# EAGLE design rfm69_rfm12b_header (EAGLE 6.5.0)
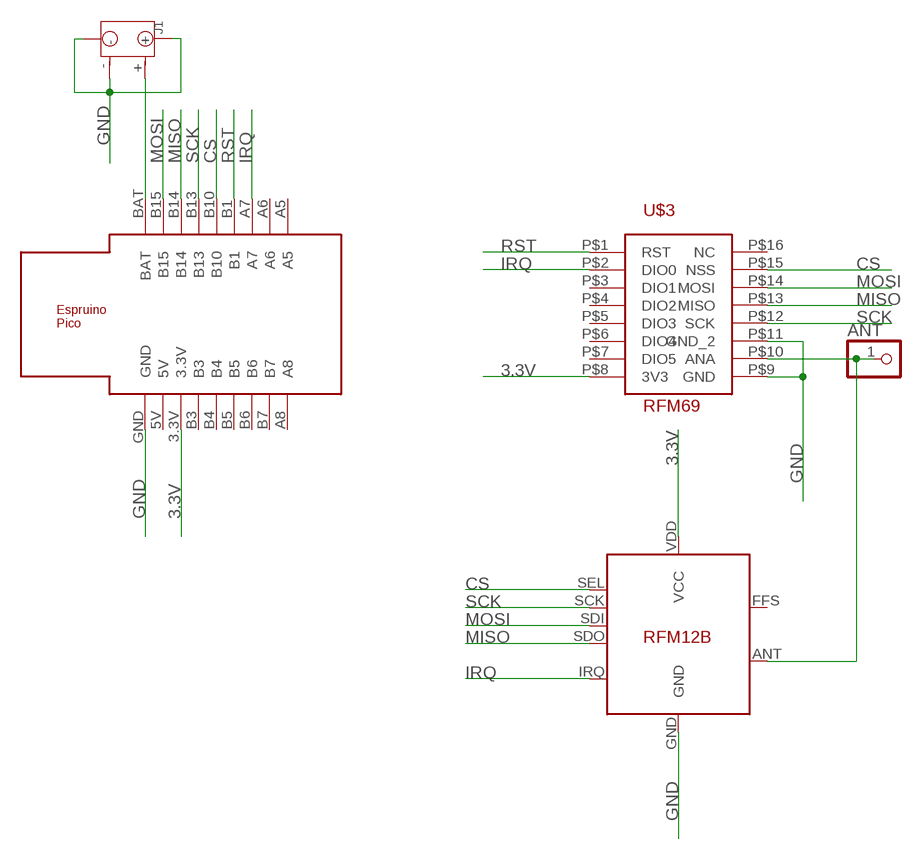
[diagram p0: schematic, sheet 1]

## Parts
ANT  PINHD-1X1  [1X01]
J1  JST-2P-SMD-PW-3410050P1  [2P-SMD-2.0-90D]
U$1  ESPRUINO_PICO_0.1  [ESPRUINO_PICO_0.1]
U$2  RFM12B  [RFM12B]
U$3  RFM69  [RFM69]

## Nets
3.3V: U$1.3.3V U$2.VDD(VCC) U$3.P$8(3V3)
CS: U$1.B10 U$2.SEL U$3.P$15(NSS)
GND: J1.3 J1.4 J1.- U$1.GND U$2.GND U$3.P$9(GND) U$3.P$11(GND_2)
IRQ: U$1.A7 U$2.IRQ U$3.P$2(DIO0)
MISO: U$1.B14 U$2.SDO U$3.P$13(MISO)
MOSI: U$1.B15 U$2.SDI U$3.P$14(MOSI)
N$1: ANT.1 U$2.ANT U$3.P$10(ANA)
N$2: J1.+ U$1.BAT
RST: U$1.B1 U$3.P$1(RST)
SCK: U$1.B13 U$2.SCK U$3.P$12(SCK)
Unconnected: U$1.5V U$1.A5 U$1.A6 U$1.A8 U$1.B3 U$1.B4 U$1.B5 U$1.B6 U$1.B7 U$2.FFS U$3.P$3(DIO1) U$3.P$4(DIO2) U$3.P$5(DIO3) U$3.P$6(DIO4) U$3.P$7(DIO5) U$3.P$16(NC)

## Library data of the parts
ANT = pinhead:PINHD-1X1: PIN HEADER
J1 = OPL Eagle Library:JST-2P-SMD-PW
U$1 = espruino_pico:ESPRUINO_PICO_0.1
U$2 = JeeParts:RFM12B
U$3 = RFM69:RFM69

## Net classes
0 default: width 0.305 mm

## Board
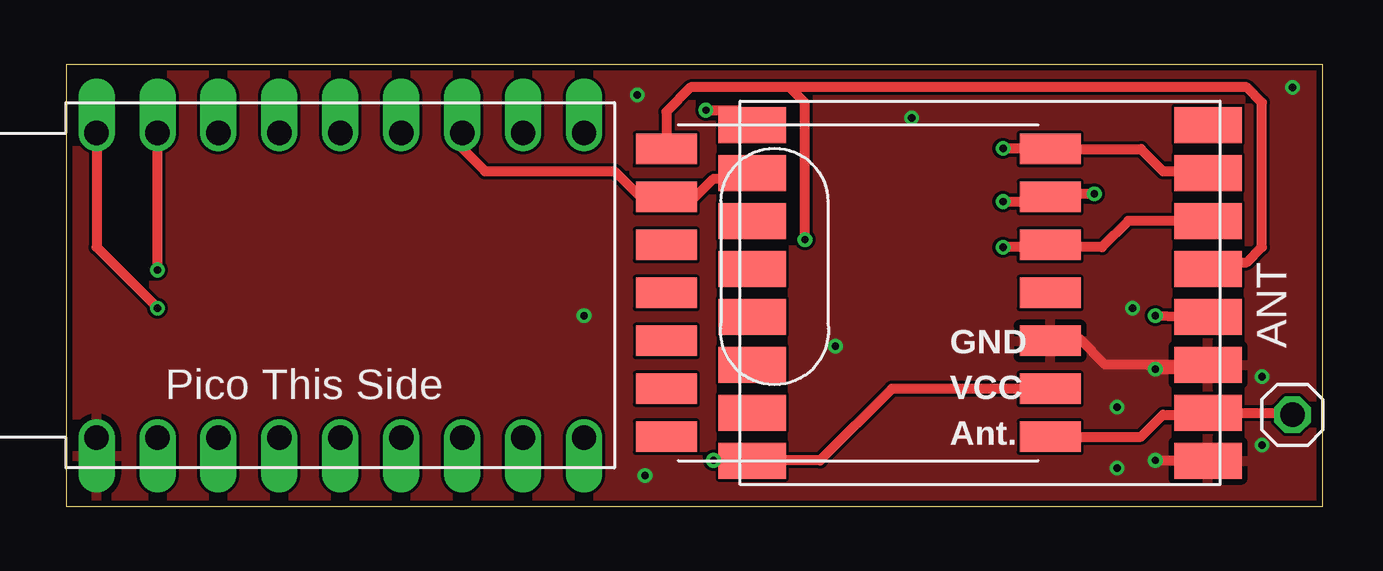
[diagram p1: board, top side]
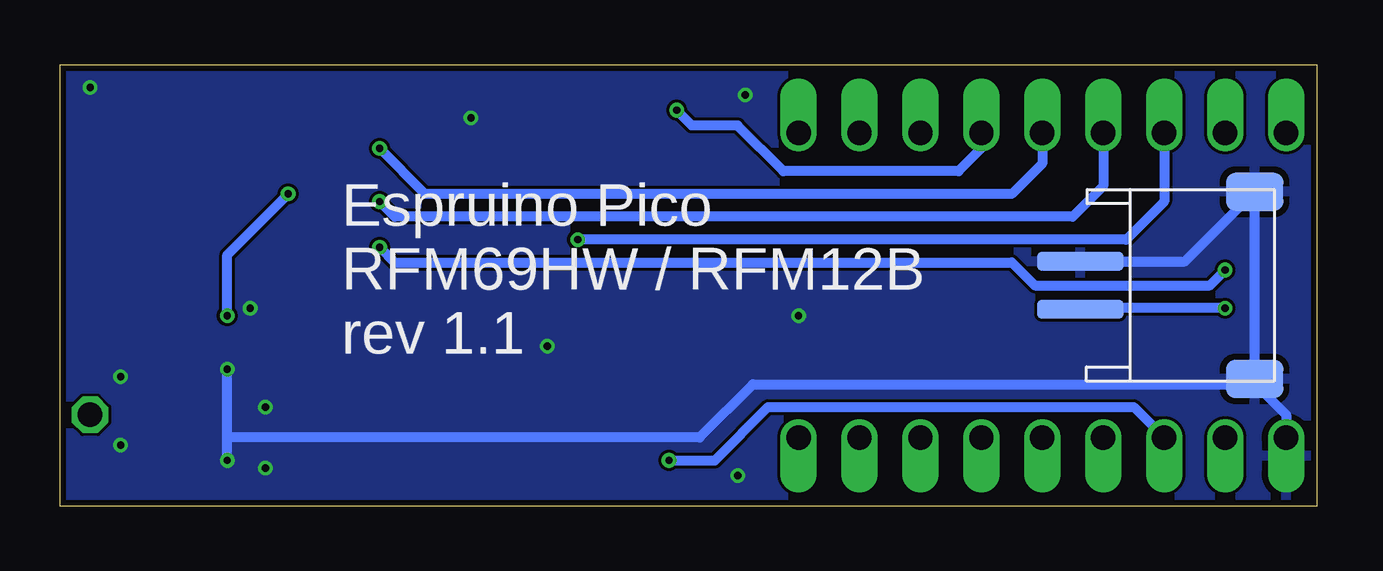
[diagram p2: board, bottom side, seen from below]

Size 52.38 x 18.41 mm. Coordinates in mm from the lower left corner, seen from the top.
Outline: 0,0 52.38,0 52.38,18.41 0,18.41 0,0
Copper layers (1*16): Top 0.035mm / dielectric 1.5mm / Bottom 0.035mm
Design rules "dirt_cheap_dirty_boards.v1": minimum track width 5mil, minimum drill 12mil, track to track 5mil, track to pad 5mil, pad to pad 5mil, via to via 5mil, smd to smd 0mil, copper to edge 10mil, drill to drill 10mil, minimum pad ring 7mil, minimum via ring 6mil, stop-mask expansion 2mil, vias tented up to drill 25mil, thermal gap 10mil

### Footprints (pad centres in the part's own frame; a part is rotated, then mirrored left to right if it is on the bottom)
1X01 = drill 1.016 octagon: 1 0,0
2P-SMD-2.0-90D = smd 1.6 x 2.4: 3 3.9,-2.181; 4 -3.9,-2.181 | smd 0.8 x 3.6: + -1,5.08; - 1,5.08
ESPRUINO_PICO_0.1 = drill 1.016 offset: 3.3V -7.62,-6.35; 5V -10.16,-6.35; A5 7.62,6.35; A6 5.08,6.35; A7 2.54,6.35; A8 7.62,-6.35; B1 0,6.35; B3 -5.08,-6.35; B4 -2.54,-6.35; B5 0,-6.35; B6 2.54,-6.35; B7 5.08,-6.35; B10 -2.54,6.35; B13 -5.08,6.35; B14 -7.62,6.35; B15 -10.16,6.35; BAT -12.7,6.35; GND -12.7,-6.35
RFM12B = smd 2.54 x 1.27: ANT 8,-6; FFS -8,2; GND 8,-2; IRQ -8,4; P$8 -8,0; P$9 -8,-2; P$10 -8,-4; P$12 -8,-6; P$16 8,0; SCK 8,4; SDI 8,2; SDO -8,6; SEL 8,6; VDD 8,-4
RFM69 = smd 2.8 x 1.5: P$1 -9.5,7; P$2 -9.5,5; P$3 -9.5,3; P$4 -9.5,1; P$5 -9.5,-1; P$6 -9.5,-3; P$7 -9.5,-5; P$8 -9.5,-7; P$9 9.5,-7; P$10 9.5,-5; P$11 9.5,-3; P$12 9.5,-1; P$13 9.5,1; P$14 9.5,3; P$15 9.5,5; P$16 9.5,7

### Placement (x,y rotation side)
ANT  51.12,3.81 0 top
J1  4.76,9.21 90 bottom
U$1  13.97,9.21 0 top
U$2  33.02,8.89 0 top
U$3  38.1,8.89 0 top

### Tracks (layer width: path | path; a pad name or v marks a point on that pad's centre or on a via)
3.3V  (via drill 0.3)
  Top 0.406: U$2.VDD 34.42,4.89 31.43,1.91 28.61,1.91 U$3.P$8 27.32,1.89 v26.99,1.91
  Bottom 0.406: v26.99,1.91 25.08,1.91 22.86,4.13 7.62,4.13 U$1.3.3V
CS  (via drill 0.3)
  Top 0.406: v39.05,14.92 40.99,14.92 U$2.SEL 44.8,14.89 45.72,13.97 47.52,13.97 U$3.P$15
  Bottom 0.406: U$1.B10 11.43,14.29 12.7,13.02 37.15,13.02 v39.05,14.92
GND  (via drill 0.3)
  Top 0.406: U$3.P$9 45.73,1.89 v45.4,1.91 | v45.4,5.71 47.42,5.71 U$3.P$11 43.32,5.89 42.23,6.99 41.12,6.99 U$2.GND
  Bottom 0.406: v45.4,1.91 45.4,2.86 | 45.4,2.86 v45.4,5.71 | 45.4,2.86 25.72,2.86 23.5,5.08 2.58,5.08 | 2.58,5.08 J1.4 J1.3 5.48,10.21 J1.- | 2.58,5.08 2.54,5.08 1.27,3.81 U$1.GND
  other vias: 44.45,8.26 49.85,5.4 49.85,2.54 43.81,1.59 43.81,4.13 32.07,6.67 24.13,1.27 21.59,7.94 23.81,17.14 35.24,16.19 51.12,17.46
  pour Bottom: -0.32,19.37 53.02,19.37 53.02,-0.95 17.78,-0.95 -0.32,-0.64
  pour Top: 0,19.05 53.34,19.05 53.34,-1.27 0,-1.27
IRQ
  Top 0.406: U$1.A7 16.51,14.92 17.46,13.97 22.86,13.97 24.13,12.7 24.83,12.7 U$2.IRQ 26.23,12.89 26.99,13.65 28.36,13.65 U$3.P$2
MISO  (via drill 0.3)
  Top 0.406: v30.8,11.11 30.8,16.83 30.16,17.46 | 30.16,17.46 26.04,17.46 25.02,16.45 U$2.SDO | U$3.P$13 47.87,10.16 49.21,10.16 49.85,10.79 49.85,16.83 49.21,17.46 30.16,17.46
  Bottom 0.406: U$1.B14 6.35,12.7 7.94,11.11 v30.8,11.11
MOSI  (via drill 0.3)
  Top 0.406: U$3.P$14 44.27,11.89 43.18,10.79 41.12,10.79 U$2.SDI 40.92,10.79 v39.05,10.79 | v3.81,9.84 U$1.B15
  Bottom 0.406: v39.05,10.79 38.42,10.16 12.7,10.16 11.75,9.21 4.45,9.21 v3.81,9.84
N$1
  Top 0.406: U$2.ANT 44.8,2.89 45.72,3.81 47.52,3.81 U$3.P$10 51.04,3.89 ANT.1
N$2  (via drill 0.3)
  Top 0.406: U$1.BAT 1.27,10.79 v3.81,8.26
  Bottom 0.406: v3.81,8.26 9.79,8.26 J1.+
RST  (via drill 0.3)
  Top 0.406: v26.67,16.51 27.98,16.51 U$3.P$1
  Bottom 0.406: U$1.B1 13.97,14.92 14.92,13.97 22.23,13.97 24.13,15.88 26.04,15.88 v26.67,16.51
SCK  (via drill 0.3)
  Top 0.406: U$3.P$12 46.4,7.89 v45.4,7.94 | v42.86,13.02 41.15,13.02 U$2.SCK 40.83,12.7 v39.05,12.7
  Bottom 0.406: v45.4,7.94 45.4,10.48 v42.86,13.02 | U$1.B13 8.89,13.34 10.16,12.06 38.42,12.06 v39.05,12.7

### Text on the board
tNames: Pico This Side
bNames: Espruino Pico / RFM69HW / RFM12B / rev 1.1